# Altium schematic sheet Основной блок.SchDoc
size A2
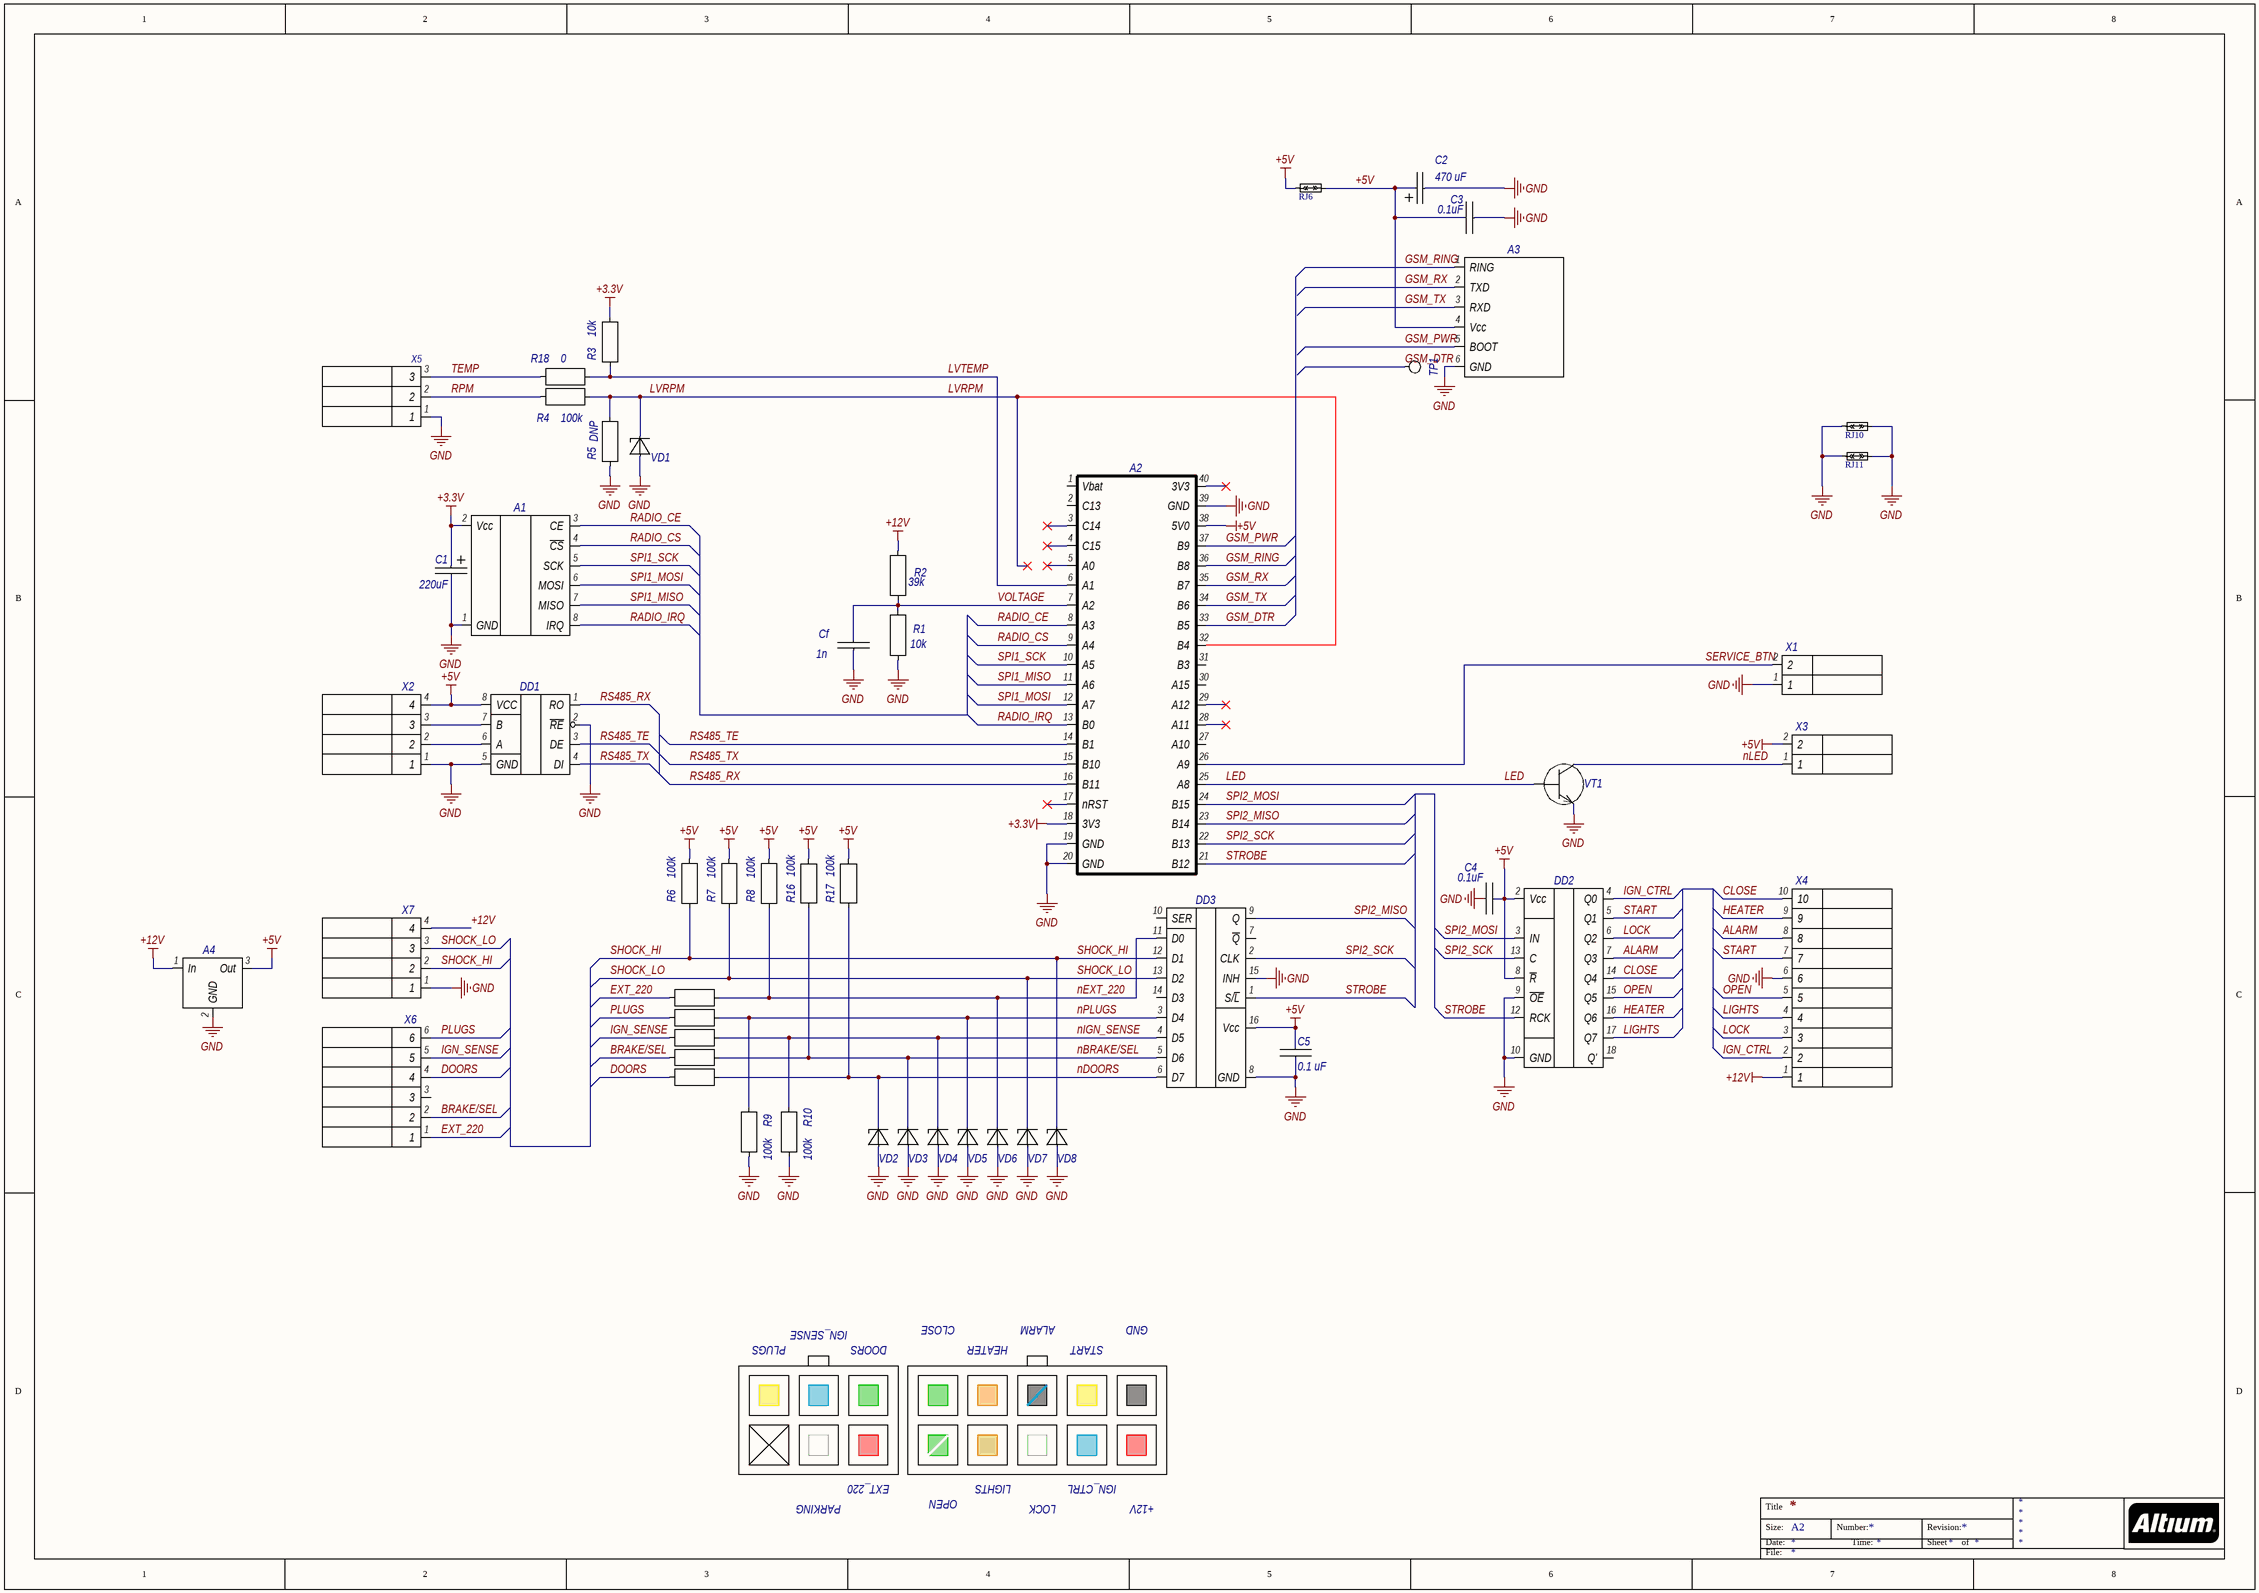
[diagram p0: Основной блок.SchDoc]

## Parts
A1  nRF24L01 + PA + LNA  [nRF24L01+PA+LNA Thruhole]  (value not drawn)
A2  STM32-1  [STM32 Module No. 1]  (value not drawn)
A3  M590E Сборка  [M590E_Module_1]  (value not drawn)
A4  LM2596 Module  [LM2596 Module]  (value not drawn)
C1  value 220uF  [CAP_TYPE_C]  (hidden comment: Конденсатор)
C2  value 470 uF  [CAP_TYPE_D]  (hidden comment: Конденсатор)
C3  value 0.1uF  [CHIP_0603_C]  (hidden comment: Конденсатор)
C4  value 0.1uF  [CHIP_0603_C]  (hidden comment: Конденсатор)
C5  value 0.1 uF  [CHIP_1206_C]  (hidden comment: Конденсатор)
Cf  value 1n  [CHIP_0603_C]  (hidden comment: Конденсатор)
DD1  ADM485AR  [SO8]  (value not drawn)
DD2  TPIC6B595  [SO20W - TPIC6B595]  (value not drawn)
DD3  74HC165  [DIP16]  (value not drawn)
R1  value 10k  [CHIP_0603_R]  (hidden comment: Резистор)
R2  value 39k  [R_0.125 - 400mil]  (hidden comment: Резистор)
R3  value 10k  [CHIP_0603_R]  (hidden comment: Резистор)
R4  value 100k  [CHIP_1206_R]  (hidden comment: Резистор)
R5  value DNP  [CHIP_0603_R]  (hidden comment: Резистор)
R6  value 100k  [CHIP_1206_R]  (hidden comment: Резистор)
R7  value 100k  [CHIP_1206_R]  (hidden comment: Резистор)
R8  value 100k  [CHIP_1206_R]  (hidden comment: Резистор)
R9  value 100k  [CHIP_1206_R]  (hidden comment: Резистор)
R10  value 100k  [CHIP_1206_R]  (hidden comment: Резистор)
R11  Резистор  [R_0.125 - 400mil]  (value not drawn)
R12  Резистор  [R_0.125 - 400mil]  (value not drawn)
R13  Резистор  [R_0.125 - 400mil]  (value not drawn)
R14  Резистор  [R_0.125 - 400mil]  (value not drawn)
R15  Резистор  [R_0.125 - 400mil]  (value not drawn)
R16  value 100k  [CHIP_1206_R]  (hidden comment: Резистор)
R17  value 100k  [CHIP_1206_R]  (hidden comment: Резистор)
R18  value 0  [CHIP_1206_R]  (hidden comment: Резистор)
RJ6  R0  [CHIP_1206_R0]  (value not drawn)
RJ10  R0  [CHIP_1206_R0]  (value not drawn)
RJ11  R0  [CHIP_1206_R0]  (value not drawn)
TP1  TEST_POINT  [Mounting hole 1.5mm]  (value not drawn)
VD1  Zener  [SOD-80]  (value not drawn)
VD2  Zener  [SOD-80]  (value not drawn)
VD3  Zener  [SOD-80]  (value not drawn)
VD4  Zener  [SOD-80]  (value not drawn)
VD5  Zener  [SOD-80]  (value not drawn)
VD6  Zener  [SOD-80]  (value not drawn)
VD7  Zener  [SOD-80]  (value not drawn)
VD8  Zener  [SOD-80]  (value not drawn)
VT1  BJT, NPN  [SOT-23]  (value not drawn)
X1  PH-02M(R)  [PH-02MR]  (value not drawn)
X2  PH-04M(R)  [PH-04M]  (value not drawn)
X3  PH-02M(R)  [PH-02MR]  (value not drawn)
X4  MF 2x05 M(R)  [MF 2x05 R]  (value not drawn)
X5  PH-03M(R)  [PH-03M]  (value not drawn)
X6  MF 2x03 M(R)  [MF 2x03 R]  (value not drawn)
X7  PH-04M(R)  [PH-04MR]  (value not drawn)

## Nets
+3.3V: A1.2(Vcc) A2.18(3V3) C1.2 R3.2
+5V: A2.38(5V0) A3.4(Vcc) A4.3(Out) C2.2 C3.1 C4.1 C5.2 DD1.8(VCC) DD2.2(Vcc) DD2.8(~{R}) DD3.16(Vcc) R6.2 R7.2 R8.2 R16.1 R17.1 RJ6.1 RJ6.2 X2.4 X3.2
+12V: A4.1(In) R2.2 X4.1 X7.4
GND: A1.1(GND) A2.19(GND) A2.20(GND) A2.39(GND) A3.6(GND) A4.2(GND) C1.1 C2.1 C3.2 C4.2 C5.1 Cf.2 DD1.2(~{RE}) DD1.5(GND) DD2.9(~{OE}) DD2.10(GND) DD3.8(GND) DD3.15(INH) R1.1 R5.1 R9.2 R10.2 RJ10.1 RJ10.2 RJ11.1 RJ11.2 VD1.1 VD2.1 VD3.1 VD4.1 VD5.1 VD6.1 VD7.1 VD8.1 VT1.3 X1.1 X2.1 X4.6 X5.1 X7.1
ALARM: DD2.7(Q3) X4.8
BRAKE/SEL: R14.1 X6.2
CLOSE: DD2.14(Q4) X4.10
DOORS: R15.1 X6.4
EXT_220: R11.1 X6.1
GSM_DTR: A2.33(B5) TP1.1
GSM_PWR: A2.37(B9) A3.5(BOOT)
GSM_RING: A2.36(B8) A3.1(RING)
GSM_RX: A2.35(B7) A3.2(TXD)
GSM_TX: A2.34(B6) A3.3(RXD)
HEATER: DD2.16(Q6) X4.9
IGN_CTRL: DD2.4(Q0) X4.2
IGN_SENSE: R13.1 X6.5
LED: A2.25(A8) VT1.1
LIGHTS: DD2.17(Q7) X4.4
LOCK: DD2.6(Q2) X4.3
LVRPM: A2.32(B4) R4.2 R5.2 VD1.2
LVTEMP: A2.6(A1) R3.1 R18.2
nBRAKE/SEL: DD3.5(D6) R14.2 R16.2 VD3.2
nDOORS: DD3.6(D7) R15.2 R17.2 VD2.2
nEXT_220: DD3.11(D0) R8.1 R11.2 VD6.2
nIGN_SENSE: DD3.4(D5) R10.1 R13.2 VD4.2
nLED: VT1.2 X3.1
nPLUGS: DD3.3(D4) R9.1 R12.2 VD5.2
OPEN: DD2.15(Q5) X4.5
PLUGS: R12.1 X6.6
RADIO_CE: A1.3(CE) A2.8(A3)
RADIO_CS: A1.4(~{CS}) A2.9(A4)
RADIO_IRQ: A1.8(IRQ) A2.13(B0)
RPM: R4.1 X5.2
RS485_RX: A2.16(B11) DD1.1(RO)
RS485_TE: A2.14(B1) DD1.3(DE)
RS485_TX: A2.15(B10) DD1.4(DI)
SERVICE_BTN: A2.26(A9) X1.2
SHOCK_HI: DD3.12(D1) R6.1 VD8.2 X7.2
SHOCK_LO: DD3.13(D2) R7.1 VD7.2 X7.3
SPI1_MISO: A1.7(MISO) A2.11(A6)
SPI1_MOSI: A1.6(MOSI) A2.12(A7)
SPI1_SCK: A1.5(SCK) A2.10(A5)
SPI2_MISO: A2.23(B14) DD3.9(Q)
SPI2_MOSI: A2.24(B15) DD2.3(IN)
SPI2_SCK: A2.22(B13) DD2.13(C) DD3.2(CLK)
START: DD2.5(Q1) X4.7
STROBE: A2.21(B12) DD2.12(RCK) DD3.1(S/~{L})
TEMP: R18.1 X5.3
VOLTAGE: A2.7(A2) Cf.1 R1.2 R2.1
NetDD1_6: DD1.6(A) X2.2
NetDD1_7: DD1.7(B) X2.3

Not connected (* = marked no-connect by the designer): A2 1(Vbat) 2(C13) 3(C14)* 4(C15)* 5(A0)* 17(nRST)* 27(A10) 28(A11)* 29(A12)* 30(A15) 31(B3) 40(3V3)*; DD2 18(Q'); DD3 7(~{Q}) 10(SER) 14(D3); X6 3

## Notes on the sheet
- PLUGS
- IGN_SENSE
- DOORS
- CLOSE
- HEATER
- ALARM
- START
- GND
- PARKING
- EXT_220
- OPEN
- LIGHTS
- LOCK
- IGN_CTRL
- +12V
- Title
- Size:
- Date:
- File:
- A2
- Number:
- Time:
- Revision:
- Sheet
- of

## Library data of the parts
A1 = nRF24L01 + PA + LNA: =PartNumber; PartNumber: nRF24L01+PA+LNA Module; Mfg: *
A2 = STM32-1: =PartNumber; PartNumber: STM32F103 "Blue Pill" Module; Mfg: *
A3 = M590E Сборка: =PartNumber; PartNumber: Neoway M590 Assy; Mfg: *
A4 = LM2596 Module: =PartNumber; PartNumber: DC-DC Converter Module
C1 = Конденсатор: =PartNumber; PartNumber: T491C227K006AT; Mfg: *
C2 = Конденсатор: =PartNumber; PartNumber: T491D477K006AT; Mfg: *
C3 C4 Cf = Конденсатор: =PartNumber; PartNumber: CC0603KRX7R7BB104; Mfg: *
C5 = Конденсатор: =PartNumber; PartNumber: CC1206KRX7R9BB104; Mfg: *
DD1 = ADM485AR: =PartNumber; PartNumber: ADM485ARZ-REEL; ID: IC002
DD2 = TPIC6B595: =PartNumber; PartNumber: TPIC6B595DW (SO20W); Mfg: *
DD3 = 74HC165: =PartNumber; PartNumber: SN74HC165N  (DIP16); Mfg: *
R1-R5 R18 = Резистор: =PartNumber; PartNumber: *; Mfg: *
R6-R10 R16 R17 = Резистор: =PartNumber; PartNumber: RC1206FR-07100KL; Mfg: *
R11-R15 = Резистор: =PartNumber; Value: 33k; PartNumber: *; Mfg: *
RJ6 RJ10 RJ11 = R0: =PartNumber; PartNumber: RC1206JR-070RL; Mfg: *
VD1 = Zener: =PartNumber; pin to pad: 1>2 2>1; PartNumber: ZMM5226B (ZMM55C-3V3); Mfg: *
VD2-VD8 = Zener: =PartNumber; pin to pad: 1>2 2>1; PartNumber: ZMM5229B (ZMM55C-4V3); Mfg: *
VT1 = BJT, NPN: =PartNumber; pin to pad: 2>3 3>2; PartNumber: KSR1002; Mfg: SAM
X1 X3 = PH-02M(R): =PartNumber; PartNumber: PH 02MR 2.0mm; Mfg: *
X2 = PH-04M(R): =PartNumber; PartNumber: PH 02M 2.0mm; Mfg: *
X4 = MF 2x05 M(R): =PartNumber; PartNumber: MF 2x05MR; Mfg: *
X5 = PH-03M(R): =PartNumber; PartNumber: PH 02M 2.0mm; Mfg: *
X6 = MF 2x03 M(R): =PartNumber; PartNumber: MF 2x03MR; Mfg: *
X7 = PH-04M(R): =PartNumber; PartNumber: PH 04MR 2.0mm; Mfg: *